# EAGLE design Sensor Board (EAGLE 9.2.2)
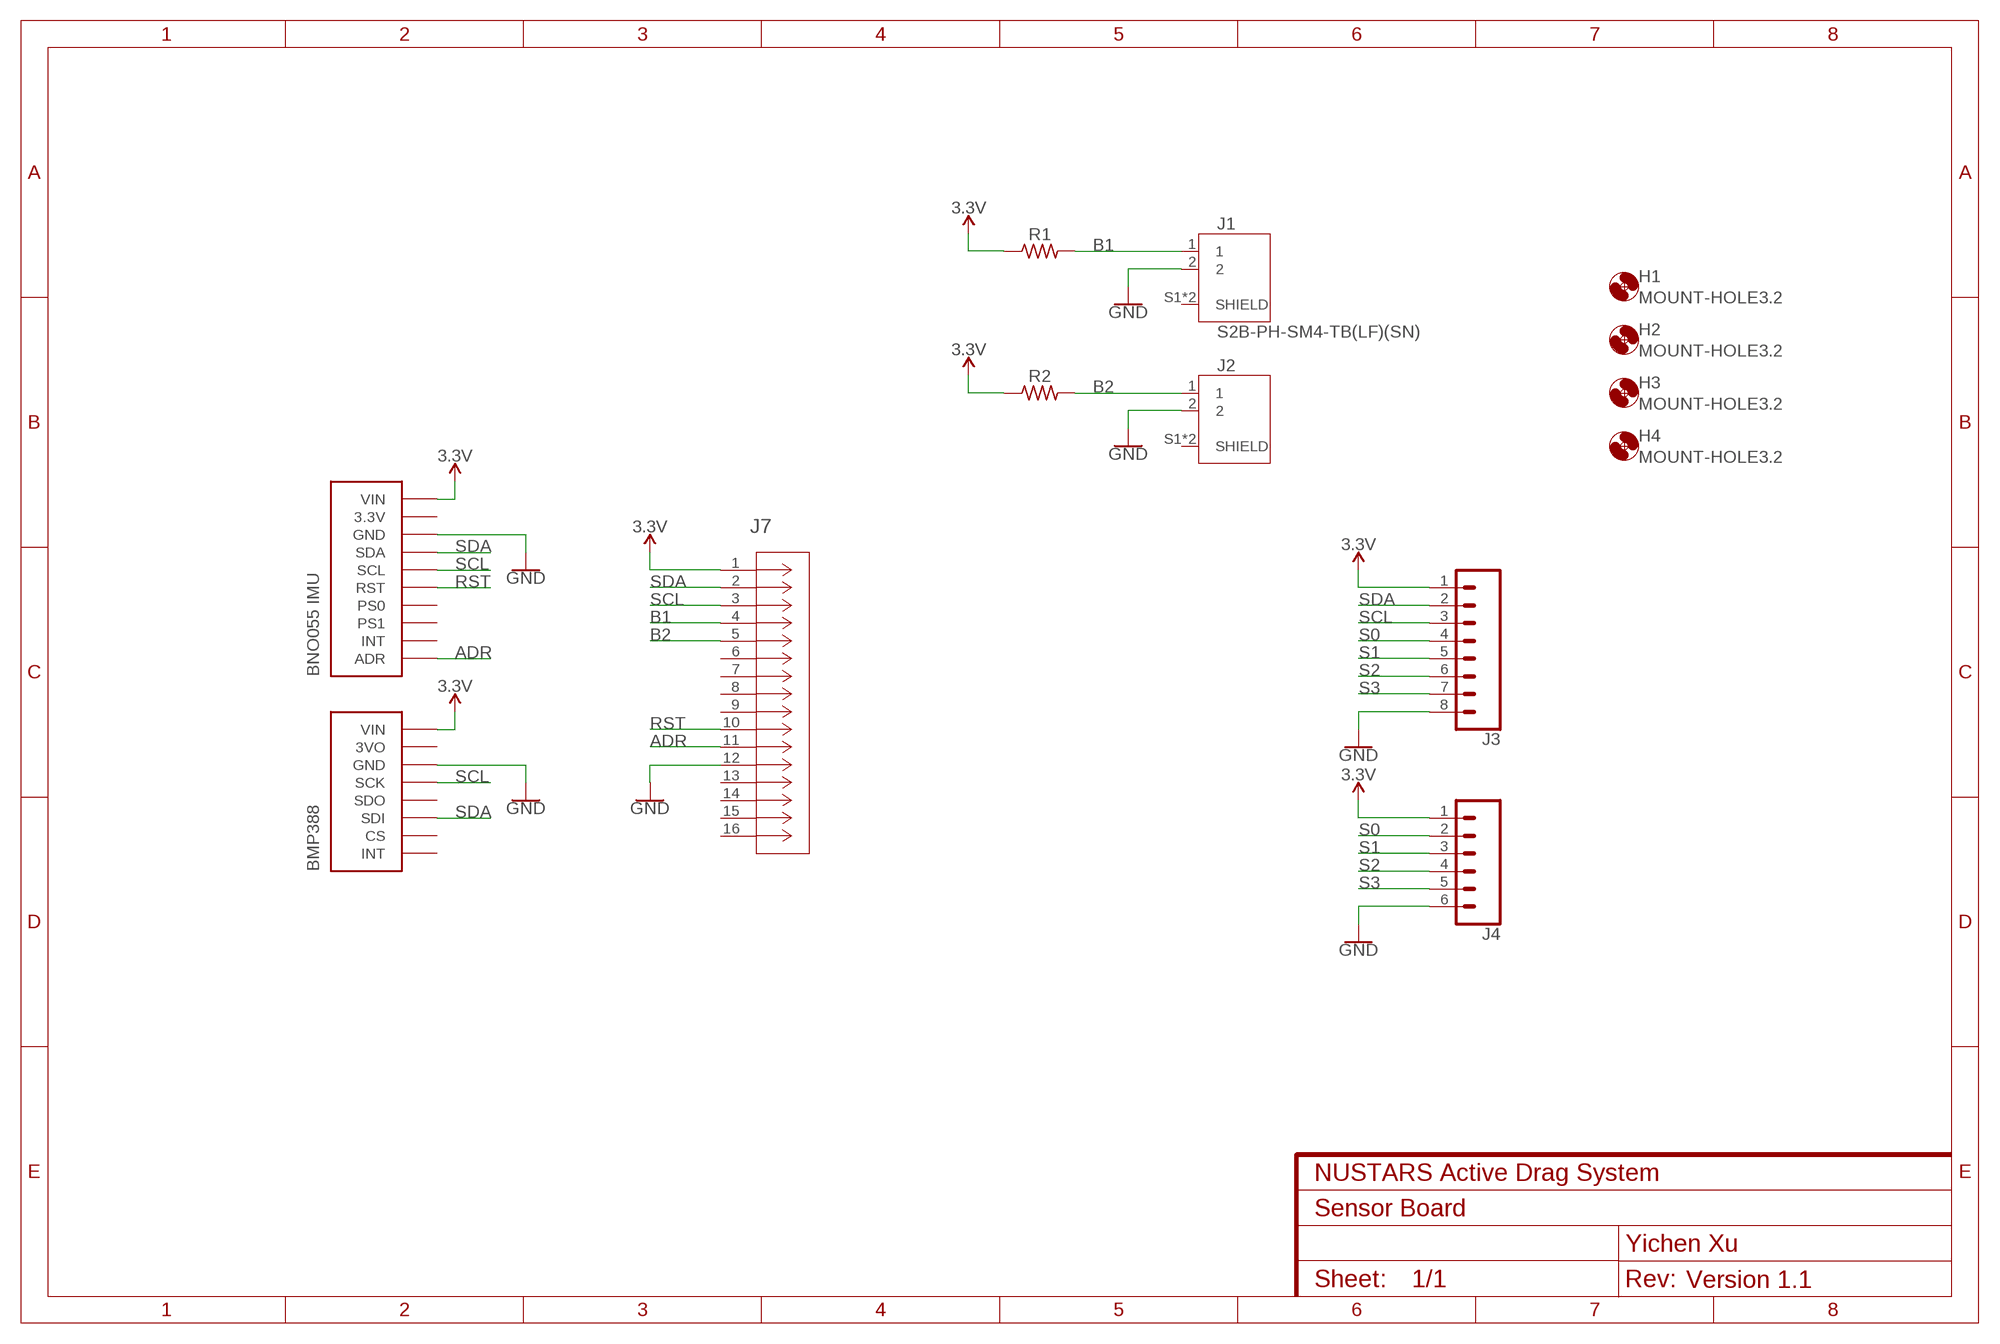
[diagram p0: schematic, sheet 1]
FRAME1 (FRAME-A4L): CNAME: NUSTARS Active Drag System; CREVISION: Version 1.1; DESIGNER: Yichen Xu

## Parts
H1  MOUNT-HOLE3.2  [3,2]
H2  MOUNT-HOLE3.2  [3,2]
H3  MOUNT-HOLE3.2  [3,2]
H4  MOUNT-HOLE3.2  [3,2]
J1  S2B-PH-SM4-TB(LF)(SN)  [JST_S2B-PH-SM4-TB(LF)(SN)]
J2  S2B-PH-SM4-TB(LF)(SN)  [JST_S2B-PH-SM4-TB(LF)(SN)]
J3  CONN_08"  [1X08]
J4  CONN_06SILK_FEMALE_PTH  [1X06]
J7  62674-121121ALF  [CON12_1X12_DUT_58XF]
R1  10k  R-US_R0805  [R0805]
R2  10k  R-US_R0805  [R0805]
U$1  BMP388  [BMP388]
U$2  BNO055  [BNO055]

## Nets
3.3V: J3.1 J4.1 J7.1 R1.1 R2.1 U$1.VIN U$2.VIN
ADR: J7.11 U$2.ADR
B1: J1.1 J7.4 R1.2
B2: J2.1 J7.5 R2.2
GND: J1.2 J2.2 J3.8 J4.6 J7.12 U$1.GND U$2.GND
RST: J7.10 U$2.RST
S0: J3.4 J4.2
S1: J3.5 J4.3
S2: J3.6 J4.4
S3: J3.7 J4.5
SCL: J3.3 J7.3 U$1.SCK U$2.SCL
SDA: J3.2 J7.2 U$1.SDI U$2.SDA
Unconnected: J1.S1(SHIELD) J1.S2(SHIELD) J2.S1(SHIELD) J2.S2(SHIELD) J7.6 J7.7 J7.8 J7.9 J7.13 J7.14 J7.15 J7.16 U$1.3VO U$1.CS U$1.INT U$1.SDO U$2.3.3V U$2.INT U$2.PS0 U$2.PS1

## Library data of the parts
H1-H4 = holes:MOUNT-HOLE: MOUNTING HOLE with drill center marker
J1 J2 = S2B-PH-SM4-TB_LF__SN_:S2B-PH-SM4-TB(LF)(SN): PH Series 2 Position 2 mm Pitch Surface Mount Side Entry Shrouded Header; DESCRIPTION: PH Series 2 Position 2 mm Pitch Surface Mount Side Entry Shrouded Header; DIGI-KEY_PART_NUMBER: 455-1749-1-ND; DIGI-KEY_PURCHASE_URL: https://www.digikey.com/product-detail/en/jst-sales-america-inc/S2B-PH-SM4-TB_LF__SN_/455-1749-1-ND/926846?utm_source=snapeda&utm_medium=aggregator&utm_campaign=symbol; MF: JST Sales; MP: S2B-PH-SM4-TB_LF__SN_; PACKAGE: FakePackage u
J3 = SparkFun-Connectors:CONN_08: Multi connection point. Often used as Generic Header-pin footprint for 0.1 inch spaced/style header connections On any of the 0.1 inch spaced packages, you can populate with these: Break Away Headers - Straight <https://www.sparkfun.com/products/116> (PRT-00116) Break Away Male Headers - Right Angle <https://www.sparkfun.com/products/553> (PRT-00553) Female Headers <https://www.sparkfun.com/products/115> (PRT-00115) Break Away Headers - Machine Pin <https://www.sparkfun.com/products/117> (PRT-00117) Break Away Female Headers - Swiss Machine Pin <https://www.sparkfun.com/products/743> (PRT-00743) Arduino Stackable Header - 8 Pin <https://www.sparkfun.com/products/9279> (PRT-09279) For SCREWTERMINALS and SPRING TERMINALS visit here: Screw Terimnals on SparkFun.com <https://www.sparkfun.com/search/results?term=Screw+Terminals> (5mm/3.5mm/2.54mm spacing) This device is also useful as a general connection point to wire up your design to another part of your project. Our various solder wires solder well into these plated through hole pads. Hook-Up Wire - Assortment (Stranded, 22 AWG) <https://www.sparkfun.com/products/11375> (PRT-11375) Hook-Up Wire - Assortment (Solid Core, 22 AWG) <https://www.sparkfun.com/products/11367> (PRT-11367) View the entire wire category on our website here <https://www.sparkfun.com/categories/141> Special notes: Molex polarized connector foot print use with SKU : PRT-08231 with associated crimp pins and housings. 1MM SMD Version SKU: PRT-10208 NOTES ON THE VARIANTS LOCK and LOCK_LONGPADS... This footprint was designed to help hold the alignment of a through-hole component (i.e. 6-pin header) while soldering it into place. You may notice that each hole has been shifted either up or down by 0.005 of an inch from it's more standard position (which is a perfectly straight line). This slight alteration caused the pins (the squares in the middle) to touch the edges of the holes. Because they are alternating, it causes a "brace" to hold the component in place. 0.005 has proven to be the perfect amount of "off-center" position when using our standard breakaway headers. Although looks a little odd when you look at the bare footprint, once you have a header in there, the alteration is very hard to notice. Also,if you push a header all the way into place, it is covered up entirely on the bottom side.; PROD_ID: CONN-08438
J4 = SparkFun-Connectors:CONN_06: Multi connection point. Often used as Generic Header-pin footprint for 0.1 inch spaced/style header connections On any of the 0.1 inch spaced packages, you can populate with these: Break Away Headers - Straight <https://www.sparkfun.com/products/116> (PRT-00116) Break Away Male Headers - Right Angle <https://www.sparkfun.com/products/553> (PRT-00553) Female Headers <https://www.sparkfun.com/products/115> (PRT-00115) Break Away Headers - Machine Pin <https://www.sparkfun.com/products/117> (PRT-00117) Break Away Female Headers - Swiss Machine Pin <https://www.sparkfun.com/products/743> (PRT-00743) Arduino Stackable Header - 6 Pin <https://www.sparkfun.com/products/9280> (PRT-09280) For SCREWTERMINALS and SPRING TERMINALS visit here: Screw Terimnals on SparkFun.com <https://www.sparkfun.com/search/results?term=Screw+Terminals> (5mm/3.5mm/2.54mm spacing) This device is also useful as a general connection point to wire up your design to another part of your project. Our various solder wires solder well into these plated through hole pads. Hook-Up Wire - Assortment (Stranded, 22 AWG) <https://www.sparkfun.com/products/11375> (PRT-11375) Hook-Up Wire - Assortment (Solid Core, 22 AWG) <https://www.sparkfun.com/products/11367> (PRT-11367) View the entire wire category on our website here <https://www.sparkfun.com/categories/141>; PROD_ID: CONN-08437
J7 = NUSTARS ADS Library:62674-121121ALF; MANUFACTURER_PART_NUMBER: 62674121121ALF; VENDOR: FCI
R1 R2 = resistor:R-US_: RESISTOR, American symbol
U$1 = NUSTARS ADS Library:BMP388
U$2 = NUSTARS ADS Library:BNO055

## Board
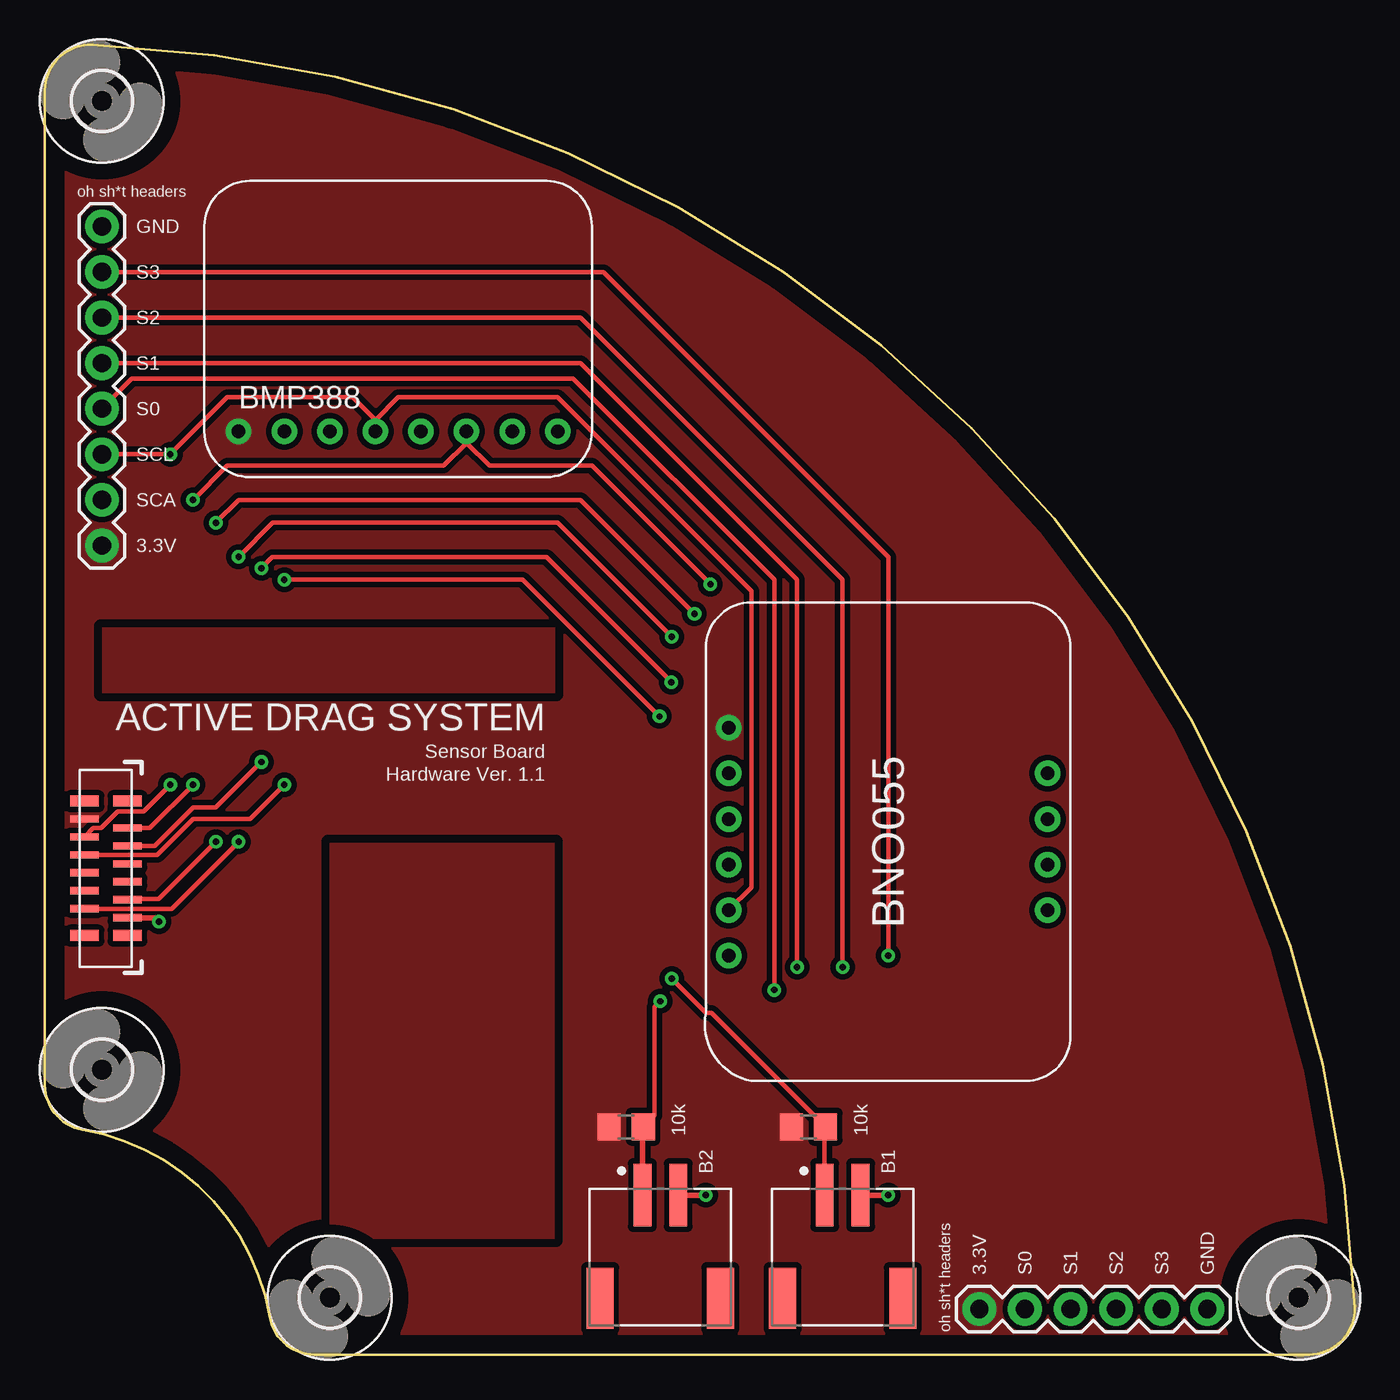
[diagram p1: board, top side]
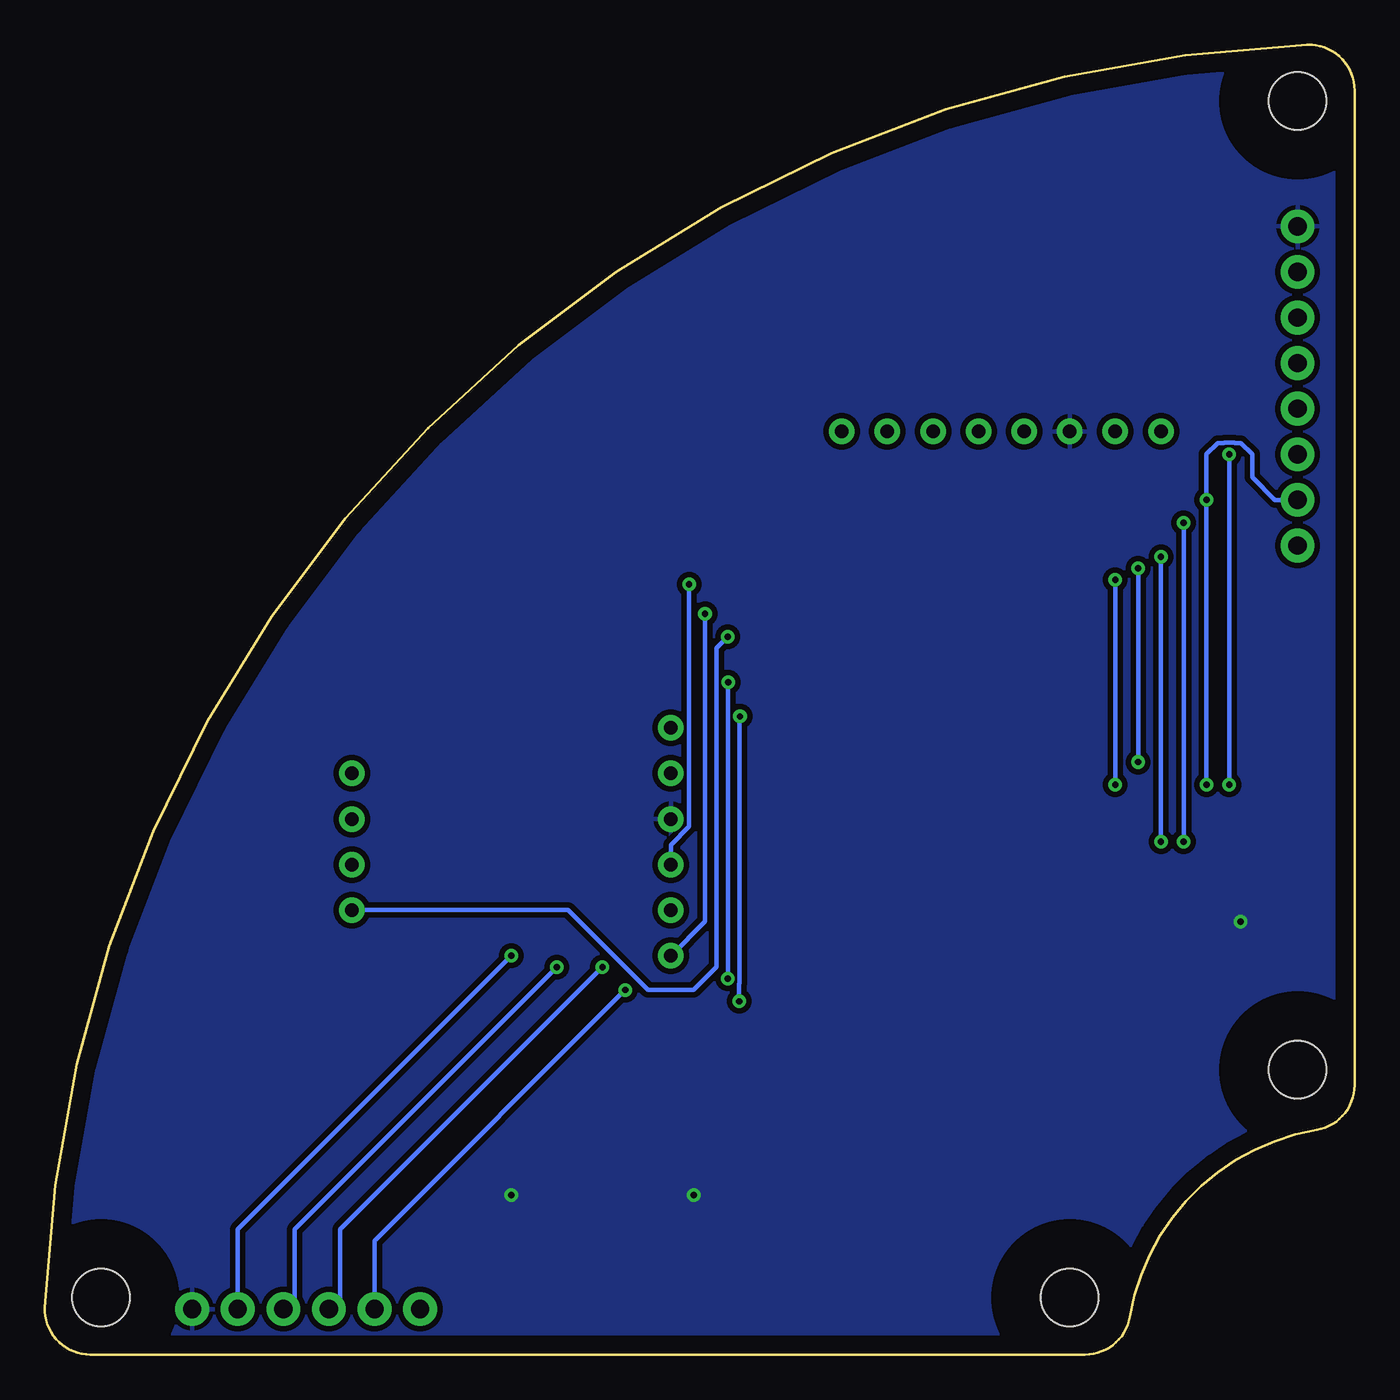
[diagram p2: board, bottom side, seen from below]

Size 72.98 x 72.98 mm. Coordinates in mm from the lower left corner, seen from the top.
Outline: 0,70.44 0,15.03 arc80 2.12,12.52 arc-71 12.52,2.12 arc80 15.03,0 70.44,0 arc92 72.98,2.63 arc86 2.63,72.98 arc92 0,70.44
Copper layers (1*16): Top 0.035mm / dielectric 1.5mm / Bottom 0.035mm
Design rules "default": minimum track width 6mil, minimum drill 0.35mm, track to track 6mil, track to pad 6mil, pad to pad 6mil, via to via 6mil, smd to smd 6mil, copper to edge 40mil, drill to drill 6mil, minimum pad ring 10mil, minimum via ring 8mil, stop-mask expansion 4mil, vias tented up to drill 0mil, thermal gap 10mil
tRestrict: 8 lines

### Footprints (pad centres in the part's own frame; a part is rotated, then mirrored left to right if it is on the bottom)
3,2 = hole 3.2: 0,0
JST_S2B-PH-SM4-TB(LF)(SN) = smd 1 x 3.5: 1 -1,0; 2 1,0 | smd 1.5 x 3.4: S1 -3.35,-5.75; S2 3.35,-5.75
1X08 = drill 1.016 pad 1.88: 1 0,0; 2 2.54,0; 3 5.08,0; 4 7.62,0; 5 10.16,0; 6 12.7,0; 7 15.24,0; 8 17.78,0
1X06 = drill 1.016 pad 1.88: 1 0,0; 2 2.54,0; 3 5.08,0; 4 7.62,0; 5 10.16,0; 6 12.7,0
CON12_1X12_DUT_58XF = smd 0.406 x 1.6: 1 0,4.775; 2 -0.5,2.388; 3 -1,4.775; 4 -1.5,2.388; 5 -2,4.775; 6 -2.5,2.388; 7 -3,4.775; 8 -3.5,2.388; 9 -4,4.775; 10 -4.5,2.388; 11 -5,4.775; 12 -5.5,2.388 | smd 0.61 x 1.6: 13 -6.497,2.388; 14 0.997,2.388; 15 -6.497,4.775; 16 0.997,4.775
R0805 = smd 1.3 x 1.5: 1 -0.95,0; 2 0.95,0
BMP388 = drill 0.75 pad 1.422: 3VO 4.445,2.54; CS 17.145,2.54; GND 6.985,2.54; INT 19.685,2.54; SCK 9.525,2.54; SDI 14.605,2.54; SDO 12.065,2.54; VIN 1.905,2.54
BNO055 = drill 0.75 pad 1.422: 3.3V 9.525,1.27; ADR 17.145,19.05; GND 12.065,1.27; INT 14.605,19.05; PS0 9.525,19.05; PS1 12.065,19.05; RST 19.685,1.27; SCL 17.145,1.27; SDA 14.605,1.27; VIN 6.985,1.27

### Placement (x,y rotation side)
H1  3.17,69.85 270 top
H2  3.17,15.88 270 top
H3  15.88,3.17 0 top
H4  69.85,3.17 270 top
J1  44.45,8.89 0 top
J2  34.29,8.89 0 top
J3  3.17,45.08 90 top
J4  52.07,2.54 0 top
J7  6.99,29.84 90 top
R1  42.54,12.7 0 top
R2  32.38,12.7 0 top
U$1  8.89,48.89 0 top
U$2  36.83,41.91 270 top

### Tracks (layer width: path | path; a pad name or v marks a point on that pad's centre or on a via)
3.3V
  pour Top (isolate 0.305, rank 6, no thermals): 0,73.02 0,-0.64 73.66,-0.64 73.66,31.11 31.75,73.02
ADR  (via drill 0.35)
  Top 0.254: J7.11 7.06,24.84 v10.79,28.57 | v10.79,44.45 12.7,46.35 28.57,46.35 v34.92,40
  Bottom 0.254: v10.79,28.57 v10.79,44.45 | U$2.ADR 43.81,24.76 39.37,20.32 36.83,20.32 35.56,21.59 35.56,39.37 v34.92,40
B1  (via drill 0.35)
  Top 0.254: J1.1 43.45,12.65 R1.2 37.14,19.05 36.83,19.05 v34.92,20.95 | v34.9,37.46 27.94,44.43 12.68,44.43 v12.06,43.81 | v12.06,33.02 9.52,30.48 8.25,30.48 6.12,28.34 J7.4
  Bottom 0.254: v34.92,20.95 34.9,20.98 v34.9,37.46 | v12.06,43.81 v12.06,33.02
B2  (via drill 0.35)
  Top 0.254: R2.2 33.97,13.33 33.97,19.36 v34.29,19.68 | J7.5 6.25,27.84 8.25,29.84 11.43,29.84 v13.33,31.75 | v34.24,35.56 26.62,43.18 v13.33,43.18
  Top 0.305: J2.1 33.29,12.65 R2.2
  Bottom 0.254: v34.29,19.68 34.29,20.66 34.27,20.68 34.27,35.54 v34.24,35.56 | v13.33,43.18 v13.33,31.75
D2
  pour Top: 3.11,40.6 28.51,40.6 28.51,36.79 3.11,36.79
DUMMY
  pour Top: 15.77,28.6 28.47,28.6 28.47,6.37 15.77,6.37
GND  (via drill 0.35)
  Top 0.305: J7.12 6.13,24.34 v6.35,24.13 | v36.83,8.89 J2.2 | J1.2 v46.99,8.89
  pour Bottom (isolate 0.305, rank 6): 0,73.02 0,13.34 13.97,-0.64 66.04,-0.64 73.66,6.99 73.66,31.11 31.75,73.02
RST  (via drill 0.35)
  Top 0.254: J7.10 4.65,25.4 6.35,25.4 v9.52,28.57 | v9.52,46.35 10.79,47.62 29.84,47.62 v36.19,41.27
  Bottom 0.254: v9.52,28.57 v9.52,46.35 | v36.19,41.27 36.19,24.13 U$2.RST
S0  (via drill 0.35)
  Top 0.254: v40.64,20.32 40.64,43.18 29.44,54.38 4.85,54.38 J3.4
  Bottom 0.254: v40.64,20.32 54.61,6.35 J4.2
S1  (via drill 0.35)
  Top 0.254: v41.91,21.59 41.91,43.18 29.84,55.24 J3.5
  Bottom 0.254: J4.3 56.51,3.17 56.51,6.98 v41.91,21.59
S2  (via drill 0.35)
  Top 0.254: J3.6 29.84,57.78 44.45,43.18 v44.45,21.59
  Bottom 0.254: v44.45,21.59 59.05,6.98 59.05,3.17 J4.4
S3  (via drill 0.35)
  Top 0.254: v46.99,22.22 46.99,44.45 31.11,60.32 J3.7
  Bottom 0.254: J4.5 62.23,6.98 v46.99,22.22
SCL  (via drill 0.35)
  Top 0.254: J7.3 2.7,29.34 3.14,29.34 4.06,30.26 5.51,30.26 6.98,31.73 v6.98,31.75 | 18.41,52.07 17.14,53.34 10.16,53.34 v6.98,50.16 J3.3 | U$2.SCL 39.37,26.03 39.37,42.54 28.57,53.34 19.68,53.34 18.41,52.07 | U$1.SCK 18.41,52.07
  Bottom 0.254: v6.98,31.75 v6.98,50.16
SDA  (via drill 0.35)
  Top 0.254: v37.08,42.93 30.48,49.53 24.76,49.53 23.49,50.8 22.22,49.53 10.16,49.53 v8.25,47.62 | J7.2 5.85,29.34 v8.25,31.75
  Top 0.305: U$1.SDI 23.49,50.8
  Bottom 0.254: U$2.SDA 38.1,28.41 37.08,29.42 v37.08,42.93 | v8.25,31.75 v8.25,47.62 8.25,50.16 7.62,50.8 7.28,50.8 7.26,50.82 6.71,50.82 6.69,50.8 6.35,50.8 5.71,50.16 5.71,48.89 4.44,47.62 J3.2

### Text on the board
tPlace: oh sh*t headers | GND | S3 | S2 | S1 | S0 | SCL | SCA | 3.3V | ACTIVE DRAG SYSTEM | Sensor Board | Hardware Ver. 1.1 | 10k | 10k | B2 | B1 | 3.3V | S0 | S1 | S2 | S3 | GND | oh sh*t headers
203bmp: C:/Users/ichis/Pictures/Cornket.bmp
207bmp: C:/Users/ichis/Pictures/NUSTARS Logo PNG.bmp